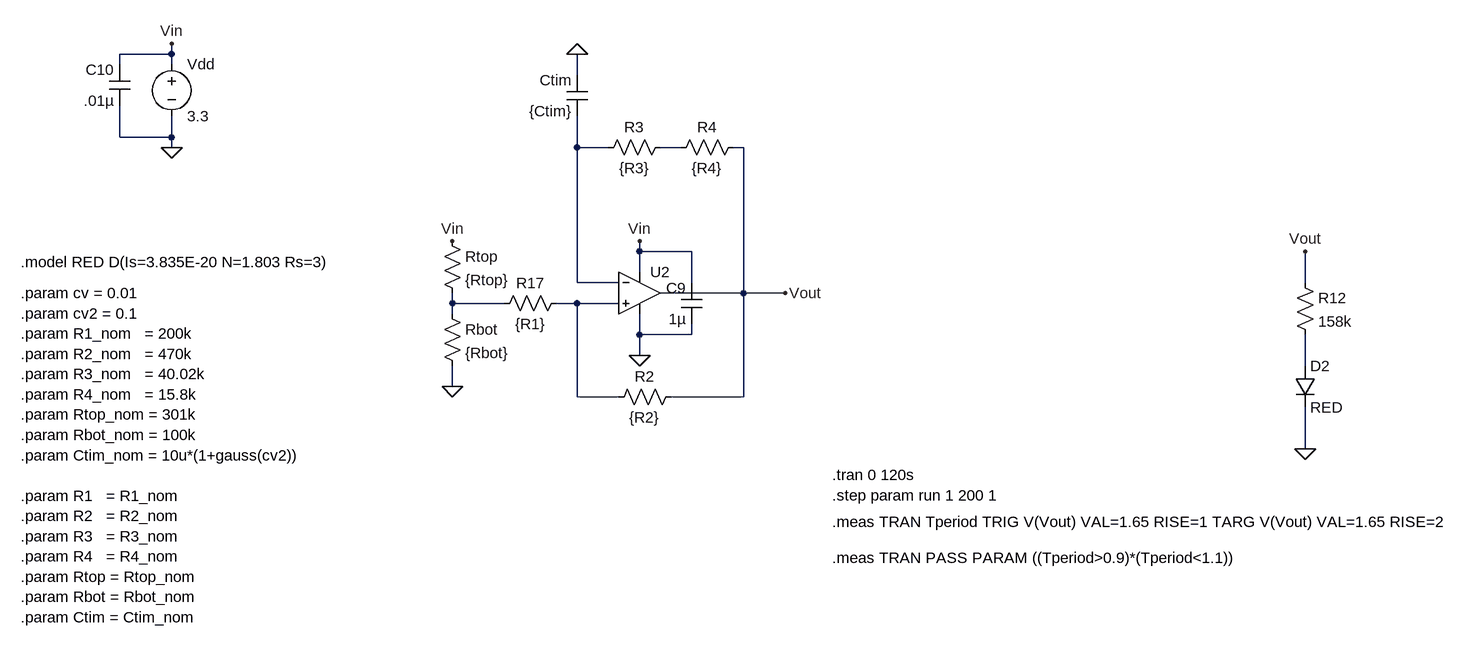
[diagram p0: schematic Mp1Sim.asc]
Mp1Sim.asc, the LTspice schematic file:
Version 4.1
SHEET 1 1872 1780
WIRE -144 768 -144 752
WIRE -144 768 -224 768
WIRE -224 784 -224 768
WIRE -144 784 -144 768
WIRE 480 800 480 768
WIRE -224 896 -224 848
WIRE -144 896 -144 864
WIRE -144 896 -224 896
WIRE -144 912 -144 896
WIRE 480 912 480 864
WIRE 528 912 480 912
WIRE 640 912 608 912
WIRE 736 912 720 912
WIRE 576 1072 576 1056
WIRE 656 1072 576 1072
WIRE 576 1104 576 1072
WIRE 480 1120 480 912
WIRE 544 1120 480 1120
WIRE 656 1120 656 1072
WIRE 1600 1120 1600 1072
WIRE 736 1136 736 912
WIRE 736 1136 608 1136
WIRE 800 1136 736 1136
WIRE 288 1152 288 1136
WIRE 368 1152 288 1152
WIRE 480 1152 448 1152
WIRE 544 1152 480 1152
WIRE 288 1168 288 1152
WIRE 576 1200 576 1168
WIRE 656 1200 656 1184
WIRE 656 1200 576 1200
WIRE 576 1232 576 1200
WIRE 1600 1248 1600 1200
WIRE 288 1280 288 1248
WIRE 480 1296 480 1152
WIRE 544 1296 480 1296
WIRE 736 1296 736 1136
WIRE 736 1296 624 1296
WIRE 1600 1376 1600 1312
FLAG 576 1232 0
FLAG -144 912 0
FLAG 576 1056 Vin
FLAG -144 752 Vin
FLAG 800 1136 Vout
FLAG 288 1280 0
FLAG 288 1056 Vin
FLAG 1600 1376 0
FLAG 1600 1072 Vout
FLAG 480 768 0
SYMBOL voltage -144 768 R0
WINDOW 123 0 0 Left 0
WINDOW 39 0 0 Left 0
SYMATTR InstName Vdd
SYMATTR Value 3.3
SYMBOL OpAmps\\UniversalOpAmp2 576 1136 R0
SYMATTR InstName U2
SYMATTR Value2 Avol=1Meg GBW=10Meg Slew=7Meg
SYMATTR SpiceLine Ilimit=25m Rail=0.05 Vos=500u
SYMATTR SpiceLine2 En=8n Enk=100 In=1f Ink=10 Rin=1T
SYMBOL res 624 896 R90
WINDOW 0 0 56 VBottom 2
WINDOW 3 32 56 VTop 2
SYMATTR InstName R3
SYMATTR Value {R3}
SYMBOL res 272 1040 R0
SYMATTR InstName Rtop
SYMATTR Value {Rtop}
SYMBOL cap 496 864 R180
WINDOW 0 24 56 Left 2
WINDOW 3 24 8 Left 2
SYMATTR InstName Ctim
SYMATTR Value {Ctim}
SYMBOL res 1584 1104 R0
SYMATTR InstName R12
SYMATTR Value 158k
SYMBOL diode 1584 1248 R0
SYMATTR InstName D2
SYMATTR Value RED
SYMBOL res 640 1280 R90
WINDOW 0 0 56 VBottom 2
WINDOW 3 32 56 VTop 2
SYMATTR InstName R2
SYMATTR Value {R2}
SYMBOL cap 672 1184 R180
WINDOW 0 24 56 Left 2
WINDOW 3 24 8 Left 2
SYMATTR InstName C9
SYMATTR Value 1µ
SYMBOL cap -208 848 R180
WINDOW 0 24 56 Left 2
WINDOW 3 24 8 Left 2
SYMATTR InstName C10
SYMATTR Value .01µ
SYMBOL res 464 1136 R90
WINDOW 0 0 56 VBottom 2
WINDOW 3 32 56 VTop 2
SYMATTR InstName R17
SYMATTR Value {R1}
SYMBOL res 272 1152 R0
SYMATTR InstName Rbot
SYMATTR Value {Rbot}
SYMBOL res 736 896 R90
WINDOW 0 0 56 VBottom 2
WINDOW 3 32 56 VTop 2
SYMATTR InstName R4
SYMATTR Value {R4}
TEXT -376 1088 Left 2 !.model RED D(Is=3.835E-20 N=1.803 Rs=3)
TEXT -376 1136 Left 2 !.param cv = 0.01\n.param cv2 = 0.1\n.param R1_nom   = 200k\n.param R2_nom   = 470k\n.param R3_nom   = 40.02k\n.param R4_nom   = 15.8k\n.param Rtop_nom = 301k\n.param Rbot_nom = 100k\n.param Ctim_nom = 10u*(1+gauss(cv2))\n \n.param R1   = R1_nom\n.param R2   = R2_nom\n.param R3   = R3_nom\n.param R4   = R4_nom\n.param Rtop = Rtop_nom\n.param Rbot = Rbot_nom\n.param Ctim = Ctim_nom
TEXT 872 1416 Left 2 !.tran 0 120s\n.step param run 1 200 1
TEXT 872 1488 Left 2 !.meas TRAN Tperiod TRIG V(Vout) VAL=1.65 RISE=1 TARG V(Vout) VAL=1.65 RISE=2
TEXT 872 1544 Left 2 !.meas TRAN PASS PARAM ((Tperiod>0.9)*(Tperiod<1.1))

The netlist it stands for:
* Mp1Sim.asc
Vdd Vin 0 3.3
X§U2 N004 N001 Vin 0 Vout level2 Avol=1Meg GBW=10Meg Slew=7Meg Ilimit=25m Rail=0.05 Vos=500u En=8n Enk=100 In=1f Ink=10 Rin=1T  ; pins In+ In- V+ V- OUT
R3 N002 N001 {R3}
Rtop Vin N003 {Rtop}
Ctim N001 0 {Ctim}
R12 Vout N005 158k
D2 N005 0 RED
R2 Vout N004 {R2}
C9 0 Vin 1µ
C10 0 Vin .01µ
R17 N004 N003 {R1}
Rbot N003 0 {Rbot}
R4 Vout N002 {R4}
.model D D
.lib standard.dio
.model RED D(Is=3.835E-20 N=1.803 Rs=3)
.param cv = 0.01
.param cv2 = 0.1
.param R1_nom   = 200k
.param R2_nom   = 470k
.param R3_nom   = 40.02k
.param R4_nom   = 15.8k
.param Rtop_nom = 301k
.param Rbot_nom = 100k
.param Ctim_nom = 10u*(1+gauss(cv2))
.param R1   = R1_nom
.param R2   = R2_nom
.param R3   = R3_nom
.param R4   = R4_nom
.param Rtop = Rtop_nom
.param Rbot = Rbot_nom
.param Ctim = Ctim_nom
.tran 0 120s
.step param run 1 200 1
.meas TRAN Tperiod TRIG V(Vout) VAL=1.65 RISE=1 TARG V(Vout) VAL=1.65 RISE=2
.meas TRAN PASS PARAM ((Tperiod>0.9)*(Tperiod<1.1))
.lib UniversalOpAmp2.lib
.backanno
.end